# Altium project GR_Alim.PrjPCB
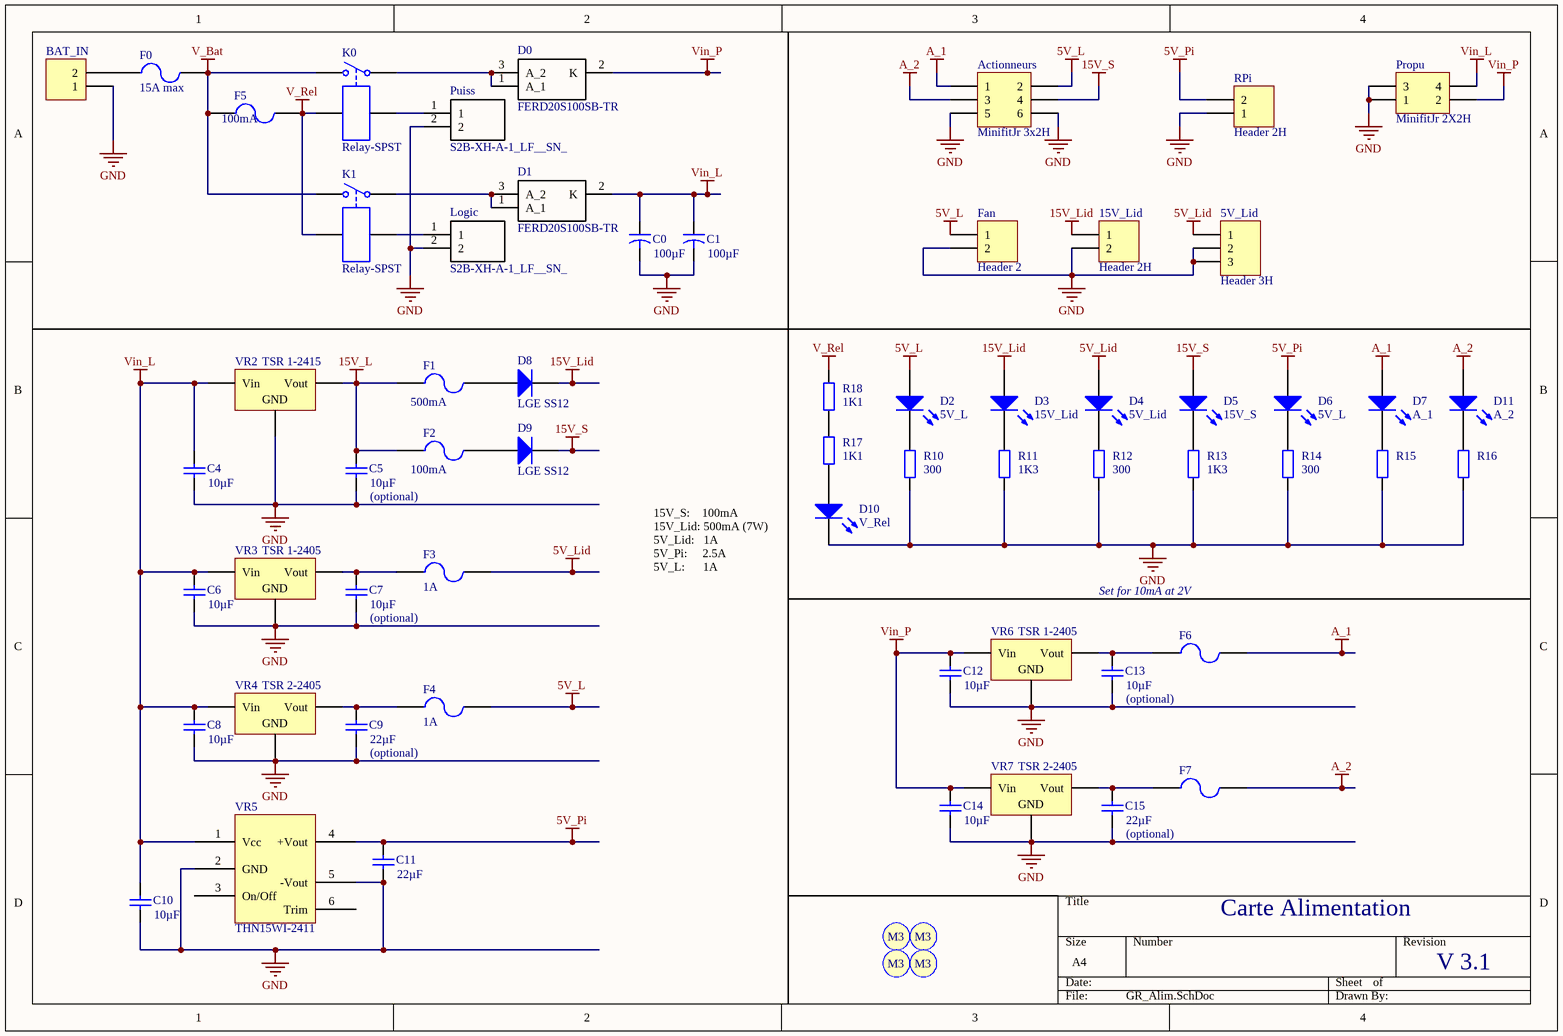
[diagram p0: GR_Alim.SchDoc]
1 sheet, 64 parts. Net scope: global (net labels, ports and power ports of the same name join across sheets).
Board file: GR_Alim.PcbDoc

## Sheet GR_Alim.SchDoc
size A4

### Parts
5V_Lid  Header 3H  [S3B-XH-A]
15V_Lid  Header 2H  [S2B-XH-A]
Actionneurs  MinifitJr 3x2H  [MOLEX_MINIFITJR_3X2H]
BAT_IN  Battery Onboard Solder  [Battery SALE]  (value not drawn)
C0  value 100µF  [Condensateur]  (hidden comment: Cap2)
C1  value 100µF  [Condensateur]  (hidden comment: Cap2)
C4  value 10µF  [Capacitor 1206]  (hidden comment: Cap)
C5  (optional)  value 10µF  [Capacitor 1206]
C6  value 10µF  [Capacitor 1206]  (hidden comment: Cap)
C7  (optional)  value 10µF  [Capacitor 1206]
C8  value 10µF  [Capacitor 1206]  (hidden comment: Cap)
C9  (optional)  value 22µF  [Capacitor 1206]
C10  value 10µF  [Capacitor 1206]  (hidden comment: Cap)
C11  value 22µF  [Capacitor 1206]  (hidden comment: Cap)
C12  value 10µF  [Capacitor 1206]  (hidden comment: Cap)
C13  (optional)  value 10µF  [Capacitor 1206]
C14  value 10µF  [Capacitor 1206]  (hidden comment: Cap)
C15  (optional)  value 22µF  [Capacitor 1206]
D0  FERD20S100SB-TR  [FERD20H100SBTR]
D1  FERD20S100SB-TR  [FERD20H100SBTR]
D2  5V_L  [KP-3216SEC]
D3  15V_Lid  [KP-3216SEC]
D4  5V_Lid  [KP-3216SEC]
D5  15V_S  [KP-3216SEC]
D6  5V_L  [KP-3216SEC]
D7  A_1  [KP-3216SEC]
D8  LGE SS12  [SMB]
D9  LGE SS12  [SMB]
D10  V_Rel  [KP-3216SEC]
D11  A_2  [KP-3216SEC]
F0  15A max  [Fuse]
F1  500mA  [3.5X2.8X1.9]
F2  100mA  [3.5X2.8X1.9]
F3  1A  [3.5X2.8X1.9]
F4  1A  [3.5X2.8X1.9]
F5  100mA  [3.5X2.8X1.9]
F6  Fuse 2  [3.5X2.8X1.9]  (value not drawn)
F7  Fuse 2  [3.5X2.8X1.9]  (value not drawn)
Fan  Header 2  [HDR1X2]
K0  Relay-SPST  [Relay]
K1  Relay-SPST  [Relay]
Logic  S2B-XH-A-1_LF__SN_  [S2B-XH-A]
Propu  MinifitJr 2X2H  [MOLEX_MINIFITJR_2X2H]
Puiss  S2B-XH-A-1_LF__SN_  [S2B-XH-A]
R10  value 300  [Resistor 1206]  (hidden comment: Res2)
R11  value 1K3  [Resistor 1206]  (hidden comment: Res2)
R12  value 300  [Resistor 1206]  (hidden comment: Res2)
R13  value 1K3  [Resistor 1206]  (hidden comment: Res2)
R14  value 300  [Resistor 1206]  (hidden comment: Res2)
R15  Res2  [Resistor 1206]  (value not drawn)
R16  Res2  [Resistor 1206]  (value not drawn)
R17  value 1K1  [Resistor 1206]  (hidden comment: Res2)
R18  value 1K1  [Resistor 1206]  (hidden comment: Res2)
RPi  Header 2H  [Molex_MiniFitJr_2x1H]
S1  Screw M3  [Screw M3]  (value not drawn)
S2  Screw M3  [Screw M3]  (value not drawn)
S3  Screw M3  [Screw M3]  (value not drawn)
S4  Screw M3  [Screw M3]  (value not drawn)
VR2  TSR 1-2415  [TRS - Both]
VR3  TSR 1-2405  [TRS - Both]
VR4  TSR 2-2405  [TRS - Both]
VR5  THN15WI-2411  [TRACO_1x1inch]
VR6  TSR 1-2405  [TRS - Both]
VR7  TSR 2-2405  [TRS - Both]

### Nets
5V_L: Actionneurs.2 D2.1(A) F4.2 Fan.1
5V_Lid: 5V_Lid.1 D4.1(A) F3.2
5V_Pi: C11.2 D6.1(A) RPi.2 VR5.4(+Vout)
15V_L: C5.2 F1.1 F2.1 VR2.3(Vout)
15V_Lid: 15V_Lid.1 D3.1(A) D8.2(K)
15V_S: Actionneurs.4 D5.1(A) D9.2(K)
A_1: Actionneurs.1 D7.1(A) F6.2
A_2: Actionneurs.3 D11.1(A) F7.2
GND: 5V_Lid.2 5V_Lid.3 15V_Lid.2 Actionneurs.5 Actionneurs.6 BAT_IN.1 C0.2 C1.2 C4.1 C5.1 C6.1 C7.1 C8.1 C9.1 C10.1 C11.1 C12.1 C13.1 C14.1 C15.1 D10.2(K) Fan.2 Logic.2 Propu.1 Propu.3 Puiss.2 R10.1 R11.1 R12.1 R13.2 R14.2 R15.2 R16.2 RPi.1 VR2.2(GND) VR3.2(GND) VR4.2(GND) VR5.2(GND) VR5.5(-Vout) VR6.2(GND) VR7.2(GND)
V_Bat: F0.2 F5.1 K0.2 K1.2
V_Rel: F5.2 K0.4 K1.4 R18.1
Vin_L: C0.1 C1.1 C4.2 C6.2 C8.2 C10.2 D1.2(K) Propu.4 VR2.1(Vin) VR3.1(Vin) VR4.1(Vin) VR5.1(Vcc)
Vin_P: C12.2 C14.2 D0.2(K) Propu.2 VR6.1(Vin) VR7.1(Vin)
NetBAT_IN_2: BAT_IN.2 F0.1
NetC7_2: C7.2 F3.1 VR3.3(Vout)
NetC9_2: C9.2 F4.1 VR4.3(Vout)
NetC13_2: C13.2 F6.1 VR6.3(Vout)
NetC15_2: C15.2 F7.1 VR7.3(Vout)
NetD0_1: D0.1(A_1) D0.3(A_2) K0.1
NetD1_1: D1.1(A_1) D1.3(A_2) K1.1
NetD2_2: D2.2(K) R10.2
NetD3_2: D3.2(K) R11.2
NetD4_2: D4.2(K) R12.2
NetD5_2: D5.2(K) R13.1
NetD6_2: D6.2(K) R14.1
NetD7_2: D7.2(K) R15.1
NetD8_1: D8.1(A) F1.2
NetD9_1: D9.1(A) F2.2
NetD10_1: D10.1(A) R17.2
NetD11_2: D11.2(K) R16.1
NetK0_3: K0.3 Puiss.1
NetK1_3: K1.3 Logic.1
NetR17_1: R17.1 R18.2

Not connected (* = marked no-connect by the designer): VR5 3(On/Off) 6(Trim)

### Notes on the sheet
- 15V_S:    100mA
  15V_Lid: 500mA (7W)
  5V_Lid:   1A
  5V_Pi:     2.5A
  5V_L:      1A
- Set for 10mA at 2V
- Carte Alimentation
- V 3.1
- (in symbol Screw M3) M3

### Library data of the parts
5V_Lid = Header 3H: Header, 3-Pin, Right Angle; LatestRevisionDate: 17-Jul-2002; LatestRevisionNote: Re-released for DXP Platform.; Publisher: Altium Limited
15V_Lid RPi = Header 2H: Header, 2-Pin, Right Angle; LatestRevisionDate: 17-Jul-2002; LatestRevisionNote: Re-released for DXP Platform.; Publisher: Altium Limited
Actionneurs = Header 3X2H: Header, 3-Pin, Dual row, Right Angle; LatestRevisionDate: 17-Jul-2002; LatestRevisionNote: Re-released for DXP Platform.; Publisher: Altium Limited
BAT_IN Fan = Header 2: Header, 2-Pin; LatestRevisionDate: 17-Jul-2002; LatestRevisionNote: Re-released for DXP Platform.; Publisher: Altium Limited
C0 C1 = Cap2: Capacitor; Published: 23-Sep-2002; PackageReference: CAPR5-4X5; Publisher: Altium Limited; PackageDescription: Capacitor; 2 Leads
C4-C15 = Cap: Capacitor; Published: 8-Jun-2000; LatestRevisionDate: 17-Jul-2002; LatestRevisionNote: Re-released for DXP Platform.; PackageReference: RAD-0.3; Publisher: Altium Limited; PackageDescription: Radial Cap, Thru-Hole; 2 Leads; 0.3 in Pin Spacing
D0 D1 = FERD20S100SB-TR: Diode; Manufacturer_Name: STMicroelectronics; Datasheet Link: https://www.mouser.com/datasheet/2/389/dm00272110-1798832.pdf; Height: 2.4mm; Manufacturer_Part_Number: FERD20S100SB-TR; Arrow Part Number: FERD20S100SB-TR; Arrow Price/Stock: https://www.arrow.com/en/products/ferd20s100sb-tr/stmicroelectronics; Mouser Part Number: 511-FERD20S100SB-TR; Mouser Price/Stock: https://www.mouser.co.uk/ProductDetail/STMicroelectronics/FERD20S100SB-TR?qs=u4fy%2FsgLU9N8IipzyIKZ6Q%3D%3D
D2-D7 D10 D11 = LED2: Typical RED, GREEN, YELLOW, AMBER GaAs LED; Published: 8-Jun-2000; LatestRevisionDate: 17-Jul-2002; LatestRevisionNote: Re-released for DXP Platform.; PackageVersion: Feb-2002; PackageReference: 3.2X1.6X1.1; Publisher: Altium Limited; PackageDescription: SM LED; 2 Flat Leads
D8 D9 = Diode: Default Diode; Published: 8-Jun-2000; LatestRevisionDate: 17-Jul-2002; LatestRevisionNote: Re-released for DXP Platform.; PackageVersion: Sep-1996; PackageReference: SMC; Publisher: Altium Limited; PackageDescription: DO-214-AB/SMC; 2 C-Bend Leads; Body 7.9 x 5.9 mm, inc. leads (LxW); Code_JEDEC: DO-214-AB
F0 = Fuse 2: Main Fuse; Published: 8-Jun-2000; LatestRevisionDate: 17-Jul-2002; LatestRevisionNote: Re-released for DXP Platform.; PackageReference: PIN-W2/E2.8; Publisher: Altium Limited; PackageDescription: Thru-Hole; 2 Leads
F1 F3-F7 = Fuse 2: Fuse; Published: 8-Jun-2000; LatestRevisionDate: 17-Jul-2002; LatestRevisionNote: Re-released for DXP Platform.; PackageReference: PIN-W2/E2.8; Publisher: Altium Limited; PackageDescription: Thru-Hole; 2 Leads
F2 = Fuse 2: MICROSMD010F-2; Published: 8-Jun-2000; LatestRevisionDate: 17-Jul-2002; LatestRevisionNote: Re-released for DXP Platform.; PackageReference: PIN-W2/E2.8; Publisher: Altium Limited; PackageDescription: Thru-Hole; 2 Leads
K0 K1 = Relay-SPST: Single-Pole Single-Throw Relay; Published: 24-Mar-1999; LatestRevisionDate: 17-Jul-2002; LatestRevisionNote: Re-released for DXP Platform.; PackageReference: MODULE4; Publisher: Altium Limited
Logic Puiss = S2B-XH-A-1_LF__SN_: Connector; Manufacturer_Name: JST (JAPAN SOLDERLESS TERMINALS); Manufacturer_Part_Number: S2B-XH-A-1(LF)(SN); Datasheet Link: http://www.jst-mfg.com/product/pdf/eng/eXH.pdf; Height: 6.1mm; Arrow Part Number: S2B-XH-A-1(LF)(SN)
Propu = Header 2X2H: Header, 2-Pin, Dual row, Right Angle; LatestRevisionDate: 17-Jul-2002; LatestRevisionNote: Re-released for DXP Platform.; Publisher: Altium Limited
R10-R18 = Res2: Resistor; Published: 8-Jun-2000; LatestRevisionDate: 17-Jul-2002; LatestRevisionNote: Re-released for DXP Platform.; PackageReference: AXIAL-0.4; Publisher: Altium Limited; PackageDescription: Axial Device, Thru-Hole; 2 Leads; 0.4 in Pin Spacing
VR2-VR4 VR6 VR7 = Volt Reg: Voltage Regulator; Published: 24-Mar-1999; LatestRevisionDate: 29-May-2009; LatestRevisionNote: IPC-7351 Footprint Added.; PackageReference: D2PAK; Publisher: Altium Limited; PackageDescription: 3-Pin Transistor Outline Package 2.54 mm Pitch, 15.1 mm Lead Span
VR5 = TEN60N: TRACO THN15WI-2411; pin to pad: 3>4 4>3; LatestRevisionDate: 17-Jul-2002; LatestRevisionNote: Re-released for DXP Platform.; Publisher: Altium Limited